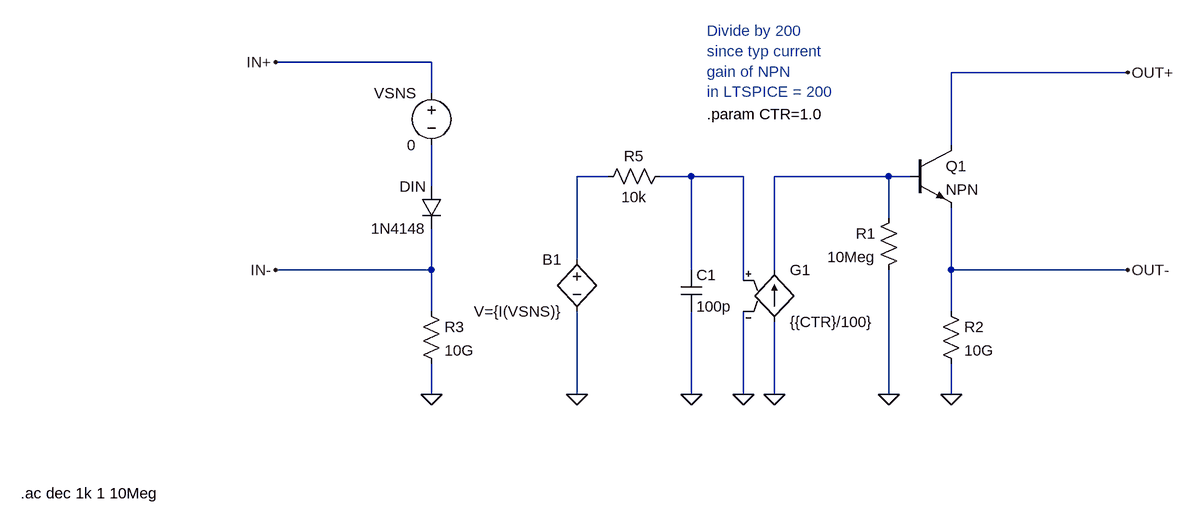
[diagram p0: schematic Discrete_Optocoupler_Test_Bench.asc]
Discrete_Optocoupler_Test_Bench.asc, the LTspice schematic file:
Version 4.1
SHEET 1 1292 680
WIRE -96 -64 -336 -64
WIRE 976 -48 704 -48
WIRE -96 -16 -96 -64
WIRE 704 64 704 -48
WIRE 176 112 128 112
WIRE 304 112 256 112
WIRE 384 112 304 112
WIRE 608 112 432 112
WIRE 640 112 608 112
WIRE -96 128 -96 64
WIRE 608 176 608 112
WIRE 128 240 128 112
WIRE -96 256 -96 192
WIRE -96 256 -336 256
WIRE 304 256 304 112
WIRE 432 256 432 112
WIRE 704 256 704 160
WIRE 976 256 704 256
WIRE 384 272 384 112
WIRE -96 320 -96 256
WIRE 704 320 704 256
WIRE -96 448 -96 400
WIRE 128 448 128 320
WIRE 304 448 304 320
WIRE 384 448 384 320
WIRE 432 448 432 336
WIRE 608 448 608 256
WIRE 704 448 704 400
FLAG 704 448 0
FLAG 608 448 0
FLAG 432 448 0
FLAG 384 448 0
FLAG 304 448 0
FLAG -336 -64 IN+
FLAG -336 256 IN-
FLAG 976 -48 OUT+
FLAG 976 256 OUT-
FLAG 128 448 0
FLAG -96 448 0
SYMBOL diode -80 128 M0
SYMATTR InstName DIN
SYMATTR Value 1N4148
SYMBOL res 624 160 M0
SYMATTR InstName R1
SYMATTR Value 10Meg
SYMBOL res 688 304 R0
SYMATTR InstName R2
SYMATTR Value 10G
SYMBOL g 432 240 R0
SYMATTR InstName G1
SYMATTR Value {{CTR}/100}
SYMBOL cap 288 256 R0
SYMATTR InstName C1
SYMATTR Value 100p
SYMBOL res 272 96 R90
WINDOW 0 0 56 VBottom 2
WINDOW 3 32 56 VTop 2
SYMATTR InstName R5
SYMATTR Value 10k
SYMBOL npn 640 64 R0
SYMATTR InstName Q1
SYMBOL bv 128 224 M0
SYMATTR InstName B1
SYMATTR Value V={I(VSNS)}
SYMBOL voltage -96 -32 M0
WINDOW 123 0 0 Left 0
WINDOW 39 0 0 Left 0
SYMATTR InstName VSNS
SYMATTR Value 0
SYMBOL res -112 304 R0
SYMATTR InstName R3
SYMATTR Value 10G
TEXT 328 16 Left 2 !.param CTR=1.0
TEXT 328 -112 Left 2 ;Divide by 200\nsince typ current\ngain of NPN\nin LTSPICE = 200
TEXT -728 600 Left 2 !.ac dec 1k 1 10Meg

The netlist it stands for:
* Discrete_Optocoupler_Test_Bench.asc
DIN N004 IN- 1N4148
R1 N003 0 10Meg
R2 OUT- 0 10G
G1 0 N003 N002 0 {{CTR}/100}
C1 N002 0 100p
R5 N002 N001 10k
Q1 OUT+ N003 OUT- 0 NPN
B1 N001 0 V={I(VSNS)}
VSNS IN+ N004 0
R3 IN- 0 10G
.model D D
.lib standard.dio
.model NPN NPN
.model PNP PNP
.lib standard.bjt
.param CTR=1.0
* Divide by 200
* since typ current
* gain of NPN
* in LTSPICE = 200
.ac dec 1k 1 10Meg
.backanno
.end